# Altium schematic sheet TX.SchDoc
size 142 x 139 mm; SheetNumber: 1; SheetTotal: 1
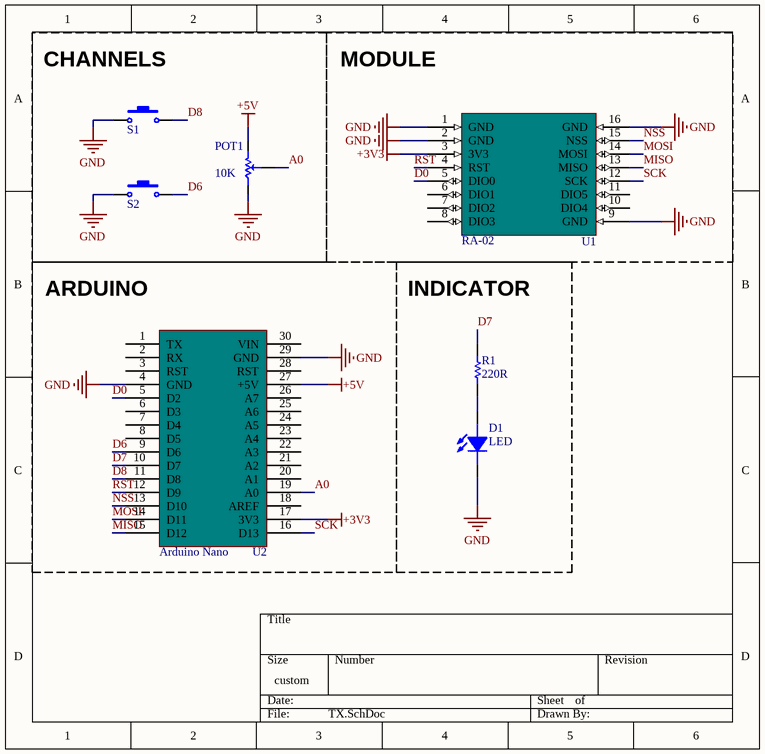
[diagram p0: TX.SchDoc]

## Parts
D1  LED  [LED3mm_GRN]
POT1  10K  [POT]
R1  220R  [RES-(1/4)]
S1  Switch PB  [Switch - Push to On]  (value not drawn)
S2  Switch PB  [Switch - Push to On]  (value not drawn)
U1  RA-02  [RA-02]
U2  Arduino Nano  [Arduino_Nano328]

## Blocks framed on the sheet
CHANNELS: POT1 S1 S2
MODULE: U1
ARDUINO: U2
INDICATOR: D1 R1

## Nets
+3V3: U1.3(3V3) U2.17(3V3)
+5V: POT1.2(CW) U2.27(+5V)
GND: D1.2(CATHODE) POT1.1(CCW) S1.1 S2.1 U1.1(GND) U1.2(GND) U1.9(GND) U1.16(GND) U2.4(GND) U2.29(GND)
A0: POT1.3(SetPoint) U2.19(A0)
D0: U1.5(DIO0) U2.5(D2)
D6: S2.2 U2.9(D6)
D7: R1.2 U2.10(D7)
D8: S1.2 U2.11(D8)
MISO: U1.13(MISO) U2.15(D12)
MOSI: U1.14(MOSI) U2.14(D11)
NSS: U1.15(NSS) U2.13(D10)
RST: U1.4(RST) U2.12(D9)
SCK: U1.12(SCK) U2.16(D13)
NetD1_1: D1.1(ANODE) R1.1

Not connected (* = marked no-connect by the designer): U1 6(DIO1) 7(DIO2) 8(DIO3) 10(DIO4) 11(DIO5); U2 1(TX) 2(RX) 3(RST) 6(D3) 7(D4) 8(D5) 18(AREF) 20(A1) 21(A2) 22(A3) 23(A4) 24(A5) 25(A6) 26(A7) 28(RST) 30(VIN)

## Library data of the parts
D1 = LED 3MM: Light Emitting Diode; Designer: Ali Hafizi
POT1 = POT: Variable Resistor; Value: 10K
R1 = RES DIP PACKAGE: TOTAL DIP RESISTOR PACK; Designer: Ali Hafizi
S1 S2 = Switch PB: Push Button Switch
U2 = Arduino Nano: Arduino Nano 328